# Altium schematic sheet 01_TOP.SchDoc
size A4; Author: Sasa Karanovic; Organization: Altium Limited; DocumentNumber: 1; SheetNumber: 1; SheetTotal: 4; sk_ProjectName: DIY E-Ink Gadget; sk_title: Top page
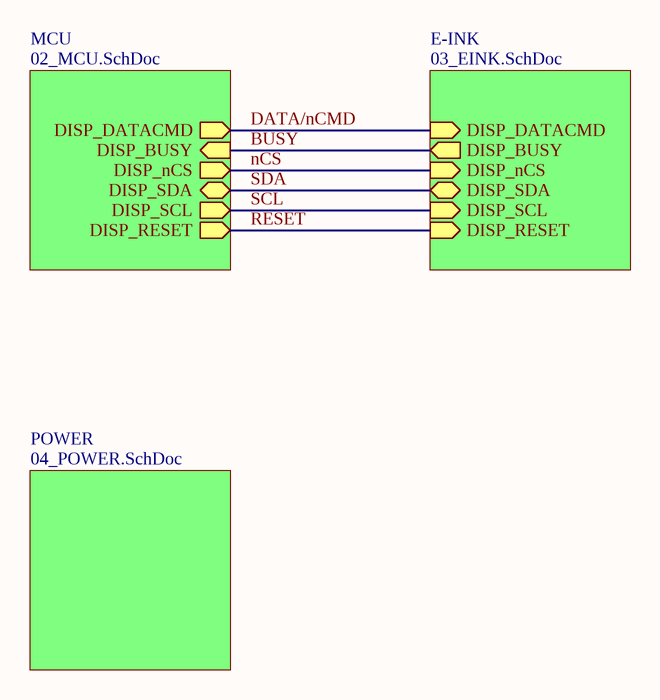
[diagram p0: 01_TOP.SchDoc]

## Sub-sheets
E-INK = 03_EINK.SchDoc: DISP_RESET (in), DISP_BUSY (out), DISP_DATACMD (in), DISP_nCS (in), DISP_SDA (bidir), DISP_SCL (in)
MCU = 02_MCU.SchDoc: DISP_SCL (out), DISP_nCS (out), DISP_BUSY (in), DISP_SDA (bidir), DISP_DATACMD (out), DISP_RESET (out)
POWER = 04_POWER.SchDoc: no entries

## Nets
BUSY: sheet MCU/DISP_BUSY, sheet E-INK/DISP_BUSY
DATA/nCMD: sheet MCU/DISP_DATACMD, sheet E-INK/DISP_DATACMD
nCS: sheet MCU/DISP_nCS, sheet E-INK/DISP_nCS
RESET: sheet MCU/DISP_RESET, sheet E-INK/DISP_RESET
SCL: sheet MCU/DISP_SCL, sheet E-INK/DISP_SCL
SDA: sheet MCU/DISP_SDA, sheet E-INK/DISP_SDA

## Notes on the sheet
- Page
- Title
- www.SasaKaranovic.com <http://www.SasaKaranovic.com>
- of